# Altium schematic sheet LED_Display.SchDoc
size A4; Organization: ENEL429 Group N; Address1: ECE Department; Address2: University of Canterbury; Address3: Christchurch 8041; Address4: New Zealand; Revision: 1
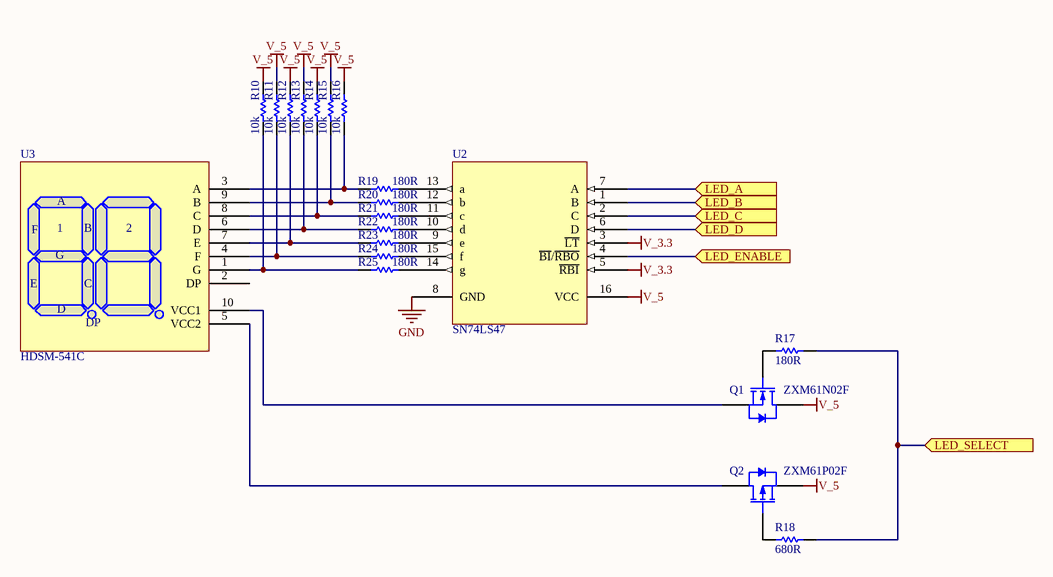
[diagram p0: LED_Display.SchDoc]

## Parts
Q1  ZXM61N02F  [SOT-23]
Q2  ZXM61P02F  [SOT23]
R10  10k  [0603]
R11  10k  [0603]
R12  10k  [0603]
R13  10k  [0603]
R14  10k  [0603]
R15  10k  [0603]
R16  10k  [0603]
R17  180R  [0603]
R18  680R  [0603]
R19  180R  [0603]
R20  180R  [0603]
R21  180R  [0603]
R22  180R  [0603]
R23  180R  [0603]
R24  180R  [0603]
R25  180R  [0603]
U2  SN74LS47  [SOP127P780X200-16N]
U3  HDSM-541C  [HDSM-541C]

## Ports
LED_A (in), LED_B (in), LED_C (in), LED_D (in), LED_ENABLE (in), LED_SELECT (in)

## Nets
GND: U2.8(GND)
V_3.3: U2.3(~{LT}) U2.5(~{RBI})
V_5: Q1.3(D) Q2.2(S) R10.2 R11.2 R12.2 R13.2 R14.2 R15.2 R16.2 U2.16(VCC)
LED_A: U2.7(A) ; port LED_A
LED_B: U2.1(B) ; port LED_B
LED_C: U2.2(C) ; port LED_C
LED_D: U2.6(D) ; port LED_D
LED_ENABLE: U2.4(~{BI}/~{RBO}) ; port LED_ENABLE
LED_SELECT: R17.2 R18.2 ; port LED_SELECT
NetQ1_1: Q1.1(G) R17.1
NetQ1_2: Q1.2(S) U3.10(VCC1)
NetQ2_1: Q2.1(G) R18.1
NetQ2_3: Q2.3(D) U3.5(VCC2)
NetR10_1: R10.1 R25.1 U3.1(G)
NetR11_1: R11.1 R24.1 U3.4(F)
NetR12_1: R12.1 R23.1 U3.7(E)
NetR13_1: R13.1 R22.1 U3.6(D)
NetR14_1: R14.1 R21.1 U3.8(C)
NetR15_1: R15.1 R20.1 U3.9(B)
NetR16_1: R16.1 R19.1 U3.3(A)
NetR19_2: R19.2 U2.13(a)
NetR20_2: R20.2 U2.12(b)
NetR21_2: R21.2 U2.11(c)
NetR22_2: R22.2 U2.10(d)
NetR23_2: R23.2 U2.9(e)
NetR24_2: R24.2 U2.15(f)
NetR25_2: R25.2 U2.14(g)

Not connected (* = marked no-connect by the designer): U3 2(DP)

## Notes on the sheet
- Title
- Drawn by:
- Date:
- Time:
- Revision:
- Sheet
- of
- File:

## Library data of the parts
Q1 = TF_ZXM61N02F: 20V N-channel enhancement mode MOSFET; Manufacturer: Zetex; Supplier 1: Element 14; Supplier Part Number 1: 9525270; price: 1.28; Supplier 2: Digi-Key; Supplier Part Number 2: ZXM61N02FCT-ND; value: ZXM61N02F; Part Number: TF_ZXM61N02F; Component Kind: Standard; Component Type: Standard; Designator: TF_ZXM61N02F; Pin Count: 3; PCB3D: sot23
Q2 = TF_ZXM61P02F: 20V P-channel enhancement mode MOSFET; Manufacturer: Zetex; Supplier 1: Element 14; Supplier Part Number 1: 9525297; price: 1.31; Supplier 2: Digi-Key; Supplier Part Number 2: ZXM61P02FCT-ND; value: ZXM61P02F; Part Number: TF_ZXM61P02F; Component Kind: Standard; Component Type: Standard; Designator: TF_ZXM61P02F; Pin Count: 3; PCB3D: sot23
R10-R16 = RS_10k 0603: RES 10.0K OHM 1/10W 1% 0603 SMD; Manufacturer: Yageo; Manufacturer PN: RC0603FR-0710KL; LatestRevisionDate: 29 May 08; Supplier 1: Digi-Key; Supplier Part Number 1: 311-10.0KHRTR-ND; Value: 10k; Part Number: RS_10k 0603; Component Kind: Standard; Component Type: Standard; Designator: RS_10k 0603; Pin Count: 2; Signal Integrity: Res; Simulation: RESISTOR
R17 R19-R25 = RS_180R 0603: RES 180OHM 1/10W 1% 0603 SMD; Manufacturer: Panasonic - ECG; Manufacturer PN: ERJ-3EKF1800V; LatestRevisionDate: 25 June 2009; Supplier 1: Digi-Key; Supplier Part Number 1: P180HTR-ND; Value: 180R; Part Number: RS_180R 0603; Component Kind: Standard; Component Type: Standard; Designator: RS_180R 0603; Pin Count: 2; Signal Integrity: Res; Simulation: RESISTOR
R18 = RS_680R 0603: RES 680 OHM 1/10W 1% 0603 SMD; Manufacturer: Yageo; Manufacturer PN: RC0603FR-07680RL; LatestRevisionDate: 29 May 08; Supplier 1: Digi-Key; Value: 680R; Supplier Part Number 1: 311-680HRTR-ND; Part Number: RS_680R 0603; Component Kind: Standard; Component Type: Standard; Designator: RS_680R 0603; Pin Count: 2; Signal Integrity: Res; Simulation: RESISTOR
U2 = SN74LS47: Manufacturer: Texas Instruments; Manufacturer PN: SN74LS47NSR; Supplier 1: Digikey; Supplier Part Number 1: 296-13223-1-ND
U3 = HDSM-541C: 2 character 7 segment display; Manufacturer: AVAGO TECHNOLOGIES; Manufacturer PN: HDSM-541C; Supplier 1: Digikey; Supplier Part Number 1: 516-2248-1-ND